# EasyEDA Pro project 2dof-experiment-system.eprj, board PCB3
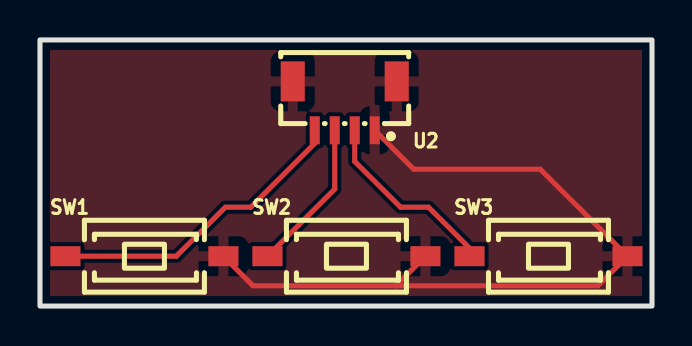
[diagram p7: board, top side]
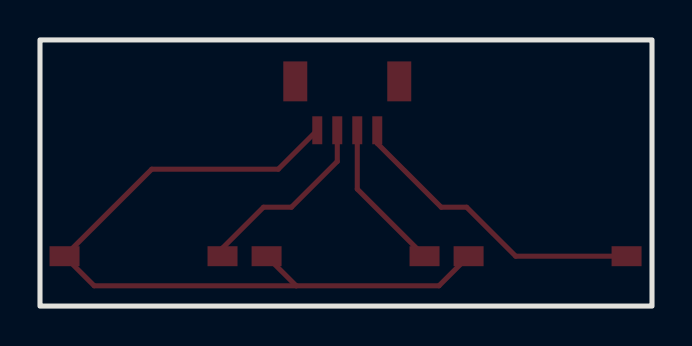
[diagram p8: board, bottom side, seen from below]

Outline 30.61 x 13.33 mm; copper layers: Top Layer, Bottom Layer. Coordinates in mm from the lower left corner of the outline.
Outline path: rectangle 0,13.33 30.61,0
Stack: Top Layer 0.035mm / Dielectric1 1.51mm FR4 er 4.5 / Bottom Layer 0.035mm

## Design rules (mm)
spacing safeClearance (default): track to track 0.152, other pairs 0.152 to 0.3
track width trackWidth (default): min 0.127, default 0.254, max 2.54
differential pair differentialPair (default): width min 0.127, default 0.254, max 2.54; gap min 0.152, default 0.152
via viaSize (default): diameter min 0.5, default 0.61, max 10; hole min 0.3, default 0.305, max 6

## Placement (name value [footprint] x y rotation side)
SW1  K2-1107ST-E1SW-06  [SW-SMD_L6.0-W3.6-LS8.0]  5.22 2.5 0 top
SW2  K2-1107ST-E1SW-06  [SW-SMD_L6.0-W3.6-LS8.0]  15.33 2.5 0 top
SW3  K2-1107ST-E1SW-06  [SW-SMD_L6.0-W3.6-LS8.0]  25.43 2.5 0 top
U2  ZX-SH1.0-4PLT  [CONN-SMD_4P-P1.00_ZX-SH1.0-4PLN]  15.24 10.03 180 top

## Footprints (pads in the part's own frame, mm; a bottom-side part is the same pattern mirrored in y, then rotated)
CONN-SMD_4P-P1.00_ZX-SH1.0-4PLN
  rect 0.5x1.4 smd: 1(-1.5,1.225) 2(-0.5,1.225) 3(0.5,1.225) 4(1.5,1.225)
  rect 1.2x2 smd: 5(2.6,-1.225) 6(-2.6,-1.225)
SW-SMD_L6.0-W3.6-LS8.0
  rect 1.5x1 smd: 1(-3.95,0) 2(3.95,0)

## Nets
As in the schematic.

## Routing (per net, layer and track width the routed paths; a pad name or vN(x,y) marks a point on that pad's centre or on a via; arc(x,y) is an arc through that point)
GND: length 38.8
  Top Layer w0.254: U2.1 18.69,6.86 25.02,6.86 SW3.2 27.9,1.02 17.79,1.02 ; SW1.2 10.66,1.02 17.79,1.02 ; 17.79,1.02 SW2.2
SW1: length 15.5
  Top Layer w0.254: SW1.1 6.82,2.5 9.27,4.95 10.54,4.95 13.74,8.15 U2.4
SW2: length 7.7
  Top Layer w0.254: U2.3 14.74,5.86 11.38,2.5
SW3: length 9.5
  Top Layer w0.254: SW3.1 21.48,2.9 19.43,4.95 18.03,4.95 15.74,7.25 U2.2

## Copper pours and planes (outline as drawn; the poured copper is in the pictures)
GND on Top Layer: 0,13.33 30.61,13.33 30.61,0 0,0
